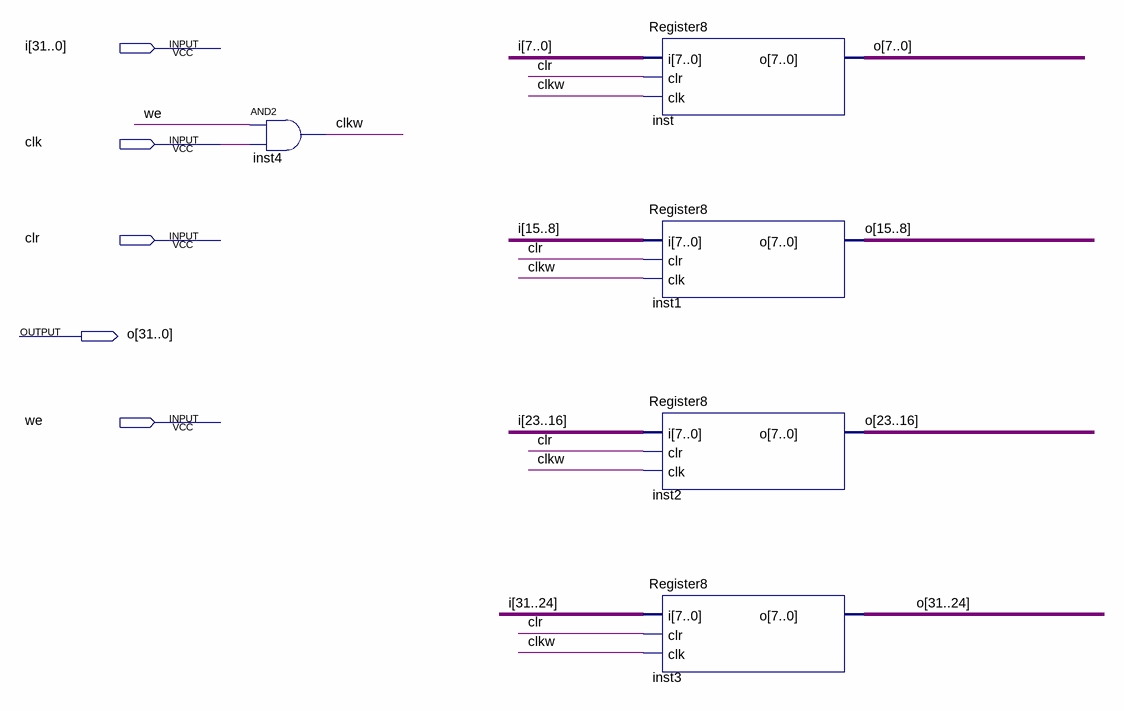
[diagram p0: schematic sheet]
// Quartus schematic Register32.bdf as structural Verilog: 5 symbols, 5 pins
module Register32 (
  input  [31:0] i,
  input  clk,
  input  clr,
  input  we,
  output [31:0] o
);

  wire clkw;

  and inst4 (clkw, we, clk);
  Register8 inst (.i(i[7:0]), .clr(clr), .clk(clkw), .o(o[7:0]));
  Register8 inst1 (.i(i[15:8]), .clr(clr), .clk(clkw), .o(o[15:8]));
  Register8 inst2 (.i(i[23:16]), .clr(clr), .clk(clkw), .o(o[23:16]));
  Register8 inst3 (.i(i[31:24]), .clr(clr), .clk(clkw), .o(o[31:24]));
endmodule
